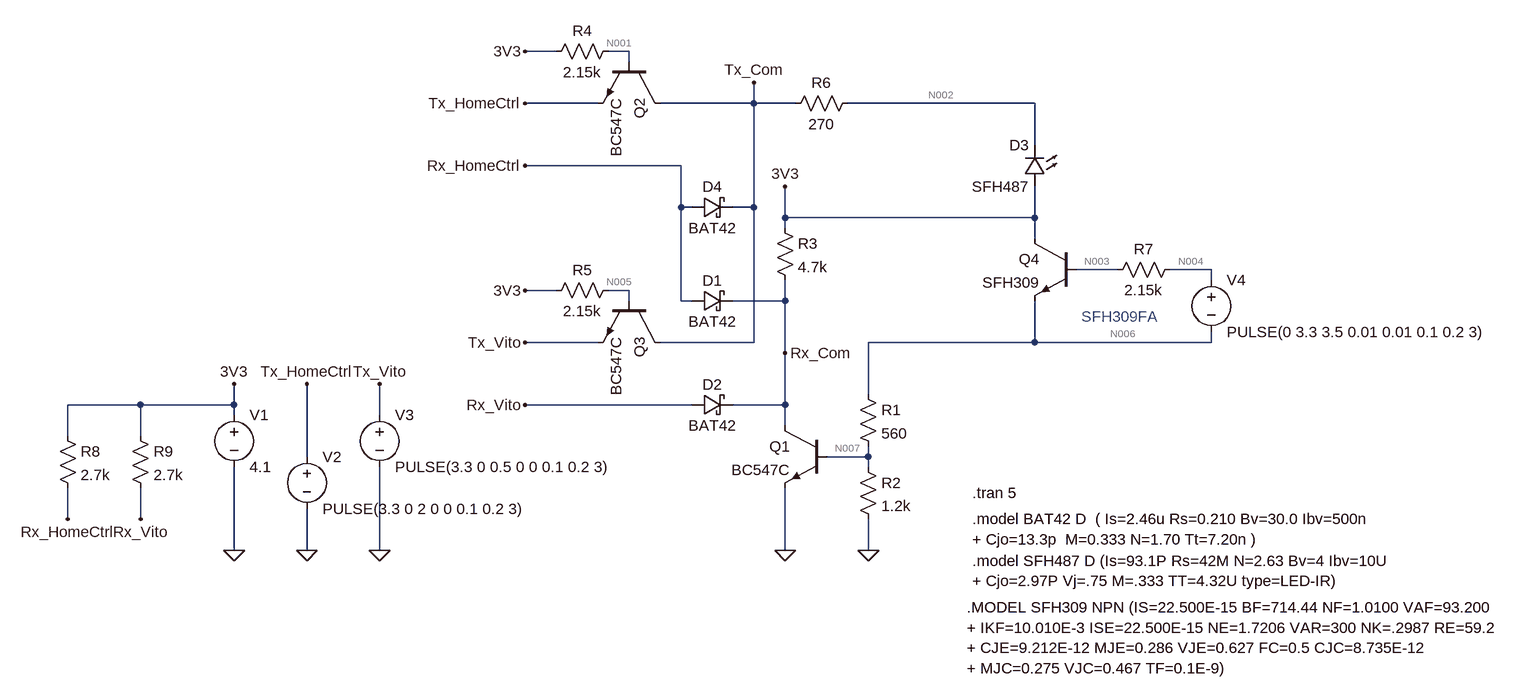
[diagram p0: schematic OptolinkDuo.asc]
OptolinkDuo.asc, the LTspice schematic file:
Version 4
SHEET 1 1868 680
WIRE -256 -1344 -304 -1344
WIRE -144 -1344 -176 -1344
WIRE -144 -1328 -144 -1344
WIRE -192 -1264 -304 -1264
WIRE 48 -1264 48 -1296
WIRE 48 -1264 -96 -1264
WIRE 112 -1264 48 -1264
WIRE 480 -1264 192 -1264
WIRE 480 -1200 480 -1264
WIRE -64 -1168 -304 -1168
WIRE -64 -1104 -64 -1168
WIRE -48 -1104 -64 -1104
WIRE 48 -1104 48 -1264
WIRE 48 -1104 16 -1104
WIRE 96 -1088 96 -1136
WIRE 480 -1088 480 -1136
WIRE 480 -1088 96 -1088
WIRE 96 -1072 96 -1088
WIRE 480 -1056 480 -1088
WIRE 608 -1008 544 -1008
WIRE 752 -1008 688 -1008
WIRE 752 -992 752 -1008
WIRE -256 -976 -304 -976
WIRE -144 -976 -176 -976
WIRE -144 -960 -144 -976
WIRE -64 -960 -64 -1104
WIRE -48 -960 -64 -960
WIRE 96 -960 96 -992
WIRE 96 -960 16 -960
WIRE -192 -896 -304 -896
WIRE 48 -896 48 -1104
WIRE 48 -896 -96 -896
WIRE 480 -896 480 -960
WIRE 480 -896 224 -896
WIRE 752 -896 752 -912
WIRE 752 -896 480 -896
WIRE 96 -880 96 -960
WIRE 224 -816 224 -896
WIRE -896 -800 -1008 -800
WIRE -752 -800 -752 -832
WIRE -752 -800 -896 -800
WIRE -48 -800 -304 -800
WIRE 96 -800 96 -880
WIRE 96 -800 16 -800
WIRE -752 -784 -752 -800
WIRE -528 -784 -528 -832
WIRE 96 -768 96 -800
WIRE -1008 -752 -1008 -800
WIRE -896 -752 -896 -800
WIRE -640 -720 -640 -832
WIRE 224 -720 224 -736
WIRE 224 -720 160 -720
WIRE 224 -704 224 -720
WIRE -1008 -624 -1008 -672
WIRE -896 -624 -896 -672
WIRE -752 -576 -752 -704
WIRE -640 -576 -640 -640
WIRE -528 -576 -528 -704
WIRE 96 -576 96 -672
WIRE 224 -576 224 -624
FLAG 224 -576 0
FLAG 96 -576 0
FLAG -304 -800 Rx_Vito
FLAG -304 -1168 Rx_HomeCtrl
FLAG -304 -1264 Tx_HomeCtrl
FLAG -304 -896 Tx_Vito
FLAG -304 -976 3V3
FLAG -304 -1344 3V3
FLAG -640 -576 0
FLAG -528 -576 0
FLAG -752 -576 0
FLAG -752 -832 3V3
FLAG -528 -832 Tx_Vito
FLAG -640 -832 Tx_HomeCtrl
FLAG 96 -1136 3V3
FLAG 48 -1296 Tx_Com
FLAG 96 -880 Rx_Com
FLAG -1008 -624 Rx_HomeCtrl
FLAG -896 -624 Rx_Vito
SYMBOL res 208 -832 R0
SYMATTR InstName R1
SYMATTR Value 560
SYMBOL res 208 -720 R0
SYMATTR InstName R2
SYMATTR Value 1.2k
SYMBOL npn 160 -768 M0
SYMATTR InstName Q1
SYMATTR Value BC547C
SYMBOL npn -96 -960 R90
SYMATTR InstName Q3
SYMATTR Value BC547C
SYMBOL schottky -48 -944 R270
WINDOW 0 32 32 VTop 2
WINDOW 3 0 32 VBottom 2
SYMATTR InstName D1
SYMATTR Value BAT42
SYMBOL schottky -48 -784 R270
WINDOW 0 32 32 VTop 2
WINDOW 3 0 32 VBottom 2
SYMATTR InstName D2
SYMATTR Value BAT42
SYMBOL res -160 -992 R90
WINDOW 0 0 56 VBottom 2
WINDOW 3 32 56 VTop 2
SYMATTR InstName R5
SYMATTR Value 2.15k
SYMBOL npn -96 -1328 R90
SYMATTR InstName Q2
SYMATTR Value BC547C
SYMBOL res -160 -1360 R90
WINDOW 0 0 56 VBottom 2
WINDOW 3 32 56 VTop 2
SYMATTR InstName R4
SYMATTR Value 2.15k
SYMBOL res 208 -1280 R90
WINDOW 0 0 56 VBottom 2
WINDOW 3 32 56 VTop 2
SYMATTR InstName R6
SYMATTR Value 270
SYMBOL LED 496 -1136 R180
WINDOW 0 24 64 Left 2
WINDOW 3 24 0 Left 2
SYMATTR InstName D3
SYMATTR Value SFH487
SYMBOL res 80 -1088 R0
SYMATTR InstName R3
SYMATTR Value 4.7k
SYMBOL schottky -48 -1088 R270
WINDOW 0 32 32 VTop 2
WINDOW 3 0 32 VBottom 2
SYMATTR InstName D4
SYMATTR Value BAT42
SYMBOL voltage -752 -800 R0
WINDOW 123 0 0 Left 0
WINDOW 39 0 0 Left 0
SYMATTR InstName V1
SYMATTR Value 4.1
SYMBOL voltage -640 -736 R0
WINDOW 123 0 0 Left 0
WINDOW 39 0 0 Left 0
SYMATTR InstName V2
SYMATTR Value PULSE(3.3 0 2 0 0 0.1 0.2 3)
SYMBOL voltage -528 -800 R0
WINDOW 123 0 0 Left 0
WINDOW 39 0 0 Left 0
SYMATTR InstName V3
SYMATTR Value PULSE(3.3 0 0.5 0 0 0.1 0.2 3)
SYMBOL npn 544 -1056 M0
SYMATTR InstName Q4
SYMATTR Value SFH309
SYMBOL res 704 -1024 R90
WINDOW 0 0 56 VBottom 2
WINDOW 3 32 56 VTop 2
SYMATTR InstName R7
SYMATTR Value 2.15k
SYMBOL voltage 752 -1008 R0
WINDOW 123 0 0 Left 0
WINDOW 39 0 0 Left 0
SYMATTR InstName V4
SYMATTR Value PULSE(0 3.3 3.5 0.01 0.01 0.1 0.2 3)
SYMBOL res -1024 -768 R0
SYMATTR InstName R8
SYMATTR Value 2.7k
SYMBOL res -912 -768 R0
SYMATTR InstName R9
SYMATTR Value 2.7k
TEXT 384 -664 Left 2 !.tran 5
TEXT 552 -936 Left 2 ;SFH309FA
TEXT 384 -624 Left 2 !.model BAT42 D  ( Is=2.46u Rs=0.210 Bv=30.0 Ibv=500n\n+ Cjo=13.3p  M=0.333 N=1.70 Tt=7.20n )
TEXT 384 -560 Left 2 !.model SFH487 D (Is=93.1P Rs=42M N=2.63 Bv=4 Ibv=10U\n+ Cjo=2.97P Vj=.75 M=.333 TT=4.32U type=LED-IR)
TEXT 376 -488 Left 2 !.MODEL SFH309 NPN (IS=22.500E-15 BF=714.44 NF=1.0100 VAF=93.200\n+ IKF=10.010E-3 ISE=22.500E-15 NE=1.7206 VAR=300 NK=.2987 RE=59.2\n+ CJE=9.212E-12 MJE=0.286 VJE=0.627 FC=0.5 CJC=8.735E-12\n+ MJC=0.275 VJC=0.467 TF=0.1E-9)

The netlist it stands for:
* OptolinkDuo.asc
R1 N006 N007 560
R2 N007 0 1.2k
Q1 Rx_Com N007 0 0 BC547C
Q3 Tx_Com N005 Tx_Vito 0 BC547C
D1 Rx_HomeCtrl Rx_Com BAT42
D2 Rx_Vito Rx_Com BAT42
R5 N005 3V3 2.15k
Q2 Tx_Com N001 Tx_HomeCtrl 0 BC547C
R4 N001 3V3 2.15k
R6 N002 Tx_Com 270
D3 3V3 N002 SFH487
R3 3V3 Rx_Com 4.7k
D4 Rx_HomeCtrl Tx_Com BAT42
V1 3V3 0 4.1
V2 Tx_HomeCtrl 0 PULSE(3.3 0 2 0 0 0.1 0.2 3)
V3 Tx_Vito 0 PULSE(3.3 0 0.5 0 0 0.1 0.2 3)
Q4 3V3 N003 N006 0 SFH309
R7 N004 N003 2.15k
V4 N004 N006 PULSE(0 3.3 3.5 0.01 0.01 0.1 0.2 3)
R8 3V3 Rx_HomeCtrl 2.7k
R9 3V3 Rx_Vito 2.7k
.model D D
.lib standard.dio
.model NPN NPN
.model PNP PNP
.lib standard.bjt
.tran 5
* SFH309FA
.model BAT42 D  ( Is=2.46u Rs=0.210 Bv=30.0 Ibv=500n
+ Cjo=13.3p  M=0.333 N=1.70 Tt=7.20n )
.model SFH487 D (Is=93.1P Rs=42M N=2.63 Bv=4 Ibv=10U
+ Cjo=2.97P Vj=.75 M=.333 TT=4.32U type=LED-IR)
.MODEL SFH309 NPN (IS=22.500E-15 BF=714.44 NF=1.0100 VAF=93.200
+ IKF=10.010E-3 ISE=22.500E-15 NE=1.7206 VAR=300 NK=.2987 RE=59.2
+ CJE=9.212E-12 MJE=0.286 VJE=0.627 FC=0.5 CJC=8.735E-12
+ MJC=0.275 VJC=0.467 TF=0.1E-9)
.backanno
.end

* Results of the author's LTspice run, read from the files saved beside the schematic
* Operating Point, zero values left out:
*   V(n006) = 12.24 nV
*   V(n007) = 9.917 nV
*   V(rx_com) = 4.091 V
*   V(tx_com) = 3.301 V
*   V(n005) = 3.92 V
*   V(tx_vito) = 3.3 V
*   V(rx_homectrl) = 3.5 V
*   V(rx_vito) = 4.099 V
*   V(3v3) = 4.1 V
*   V(n001) = 3.92 V
*   V(tx_homectrl) = 3.3 V
*   V(n002) = 3.304 V
*   V(n003) = 21.1 nV
*   V(n004) = 12.24 nV
*   Ic(Q4) = 4.146 pA
*   Ib(Q4) = -4.123 pA
*   Ic(Q2) = 117.9 µA
*   Ib(Q2) = 83.93 µA
*   Ie(Q2) = -201.8 µA
*   Ic(Q3) = 117.9 µA
*   Ib(Q3) = 83.93 µA
*   Ie(Q3) = -201.8 µA
*   Ic(Q1) = 4.169 pA
*   Ib(Q1) = -4.118 pA
*   I(D3) = 11.2 µA
*   I(D4) = 224.6 µA
*   I(D2) = 487.7 nA
*   I(D1) = -2.46 µA
*   I(R9) = 487.7 nA
*   I(R8) = 222.1 µA
*   I(R7) = -4.123 pA
*   I(R3) = 1.972 µA
*   I(R6) = 11.2 µA
*   I(R4) = -83.93 µA
*   I(R5) = -83.93 µA
*   I(R2) = 8.264 pA
*   I(R1) = 4.146 pA
*   I(V4) = 4.123 pA
*   I(V3) = 201.8 µA
*   I(V2) = 201.8 µA
*   I(V1) = -403.7 µA
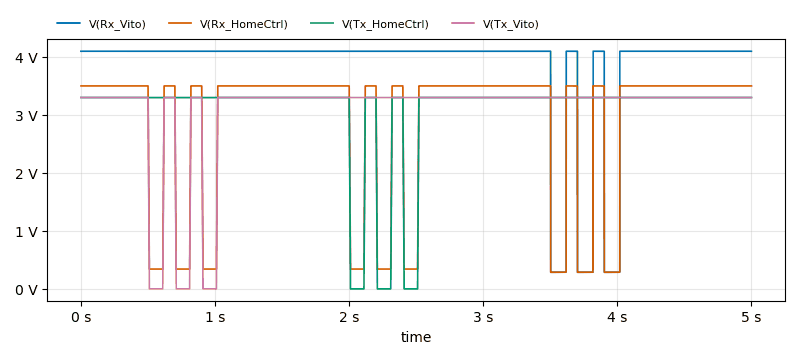
[diagram p1: Transient Analysis of OptolinkDuo.asc, plotted from the saved traces]
* Transient Analysis, 1 run:
*   V(Rx_Vito): min 285.8 mV, max 4.099 V, average 3.833 V, rms 3.954 V, last 4.099 V
*   V(Rx_HomeCtrl): min 285.9 mV, max 3.5 V, average 2.86 V, rms 3.125 V, last 3.5 V
*   V(Tx_HomeCtrl): min 0 V, max 3.3 V, average 3.082 V, rms 3.186 V, last 3.3 V
*   V(Tx_Vito): min 0 V, max 3.3 V, average 3.082 V, rms 3.186 V, last 3.3 V